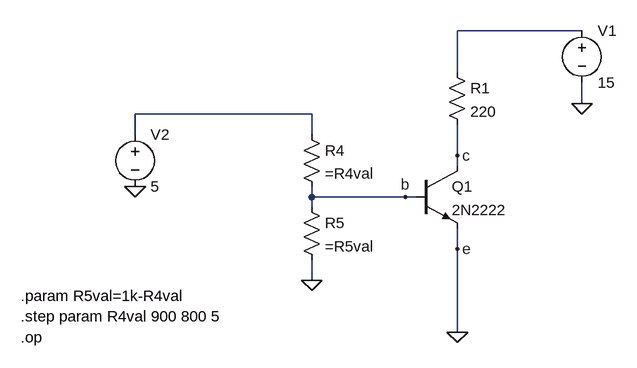
[diagram p0: schematic tranzystor.asc]
tranzystor.asc, the LTspice schematic file:
Version 4
SHEET 1 880 680
WIRE 384 -80 192 -80
WIRE 192 -16 192 -80
WIRE 384 32 384 0
WIRE -32 48 -304 48
WIRE -304 80 -304 48
WIRE -32 80 -32 48
WIRE 192 112 192 64
WIRE 192 128 192 112
WIRE -32 176 -32 160
WIRE 112 176 -32 176
WIRE 128 176 112 176
WIRE -32 192 -32 176
WIRE 192 256 192 224
WIRE -32 304 -32 272
WIRE 192 384 192 256
FLAG 384 32 0
FLAG -304 160 0
FLAG 192 384 0
FLAG -32 304 0
FLAG 192 112 c
FLAG 112 176 b
FLAG 192 256 e
SYMBOL npn 128 128 R0
SYMATTR InstName Q1
SYMATTR Value 2N2222
SYMBOL res 176 -32 R0
SYMATTR InstName R1
SYMATTR Value 220
SYMBOL voltage 384 -96 R0
WINDOW 123 0 0 Left 0
WINDOW 39 0 0 Left 0
SYMATTR InstName V1
SYMATTR Value 15
SYMBOL voltage -304 64 R0
WINDOW 123 0 0 Left 0
WINDOW 39 0 0 Left 0
SYMATTR InstName V2
SYMATTR Value 5
SYMBOL res -48 64 R0
SYMATTR InstName R4
SYMATTR Value =R4val
SYMBOL res -48 176 R0
SYMATTR InstName R5
SYMATTR Value =R5val
TEXT -480 392 Left 0 !.op
TEXT -480 360 Left 0 !.step param R4val 900 800 5
TEXT -480 328 Left 0 !.param R5val=1k-R4val

The netlist it stands for:
* tranzystor.asc
Q1 c b 0 0 2N2222
R1 N001 c 220
V1 N001 0 15
V2 N002 0 5
R4 N002 b =R4val
R5 b 0 =R5val
.model NPN NPN
.model PNP PNP
.lib standard.bjt
.op
.step param R4val 900 800 5
.param R5val=1k-R4val
.backanno
.end